# EAGLE design Gamepad (EAGLE 9.6.2)
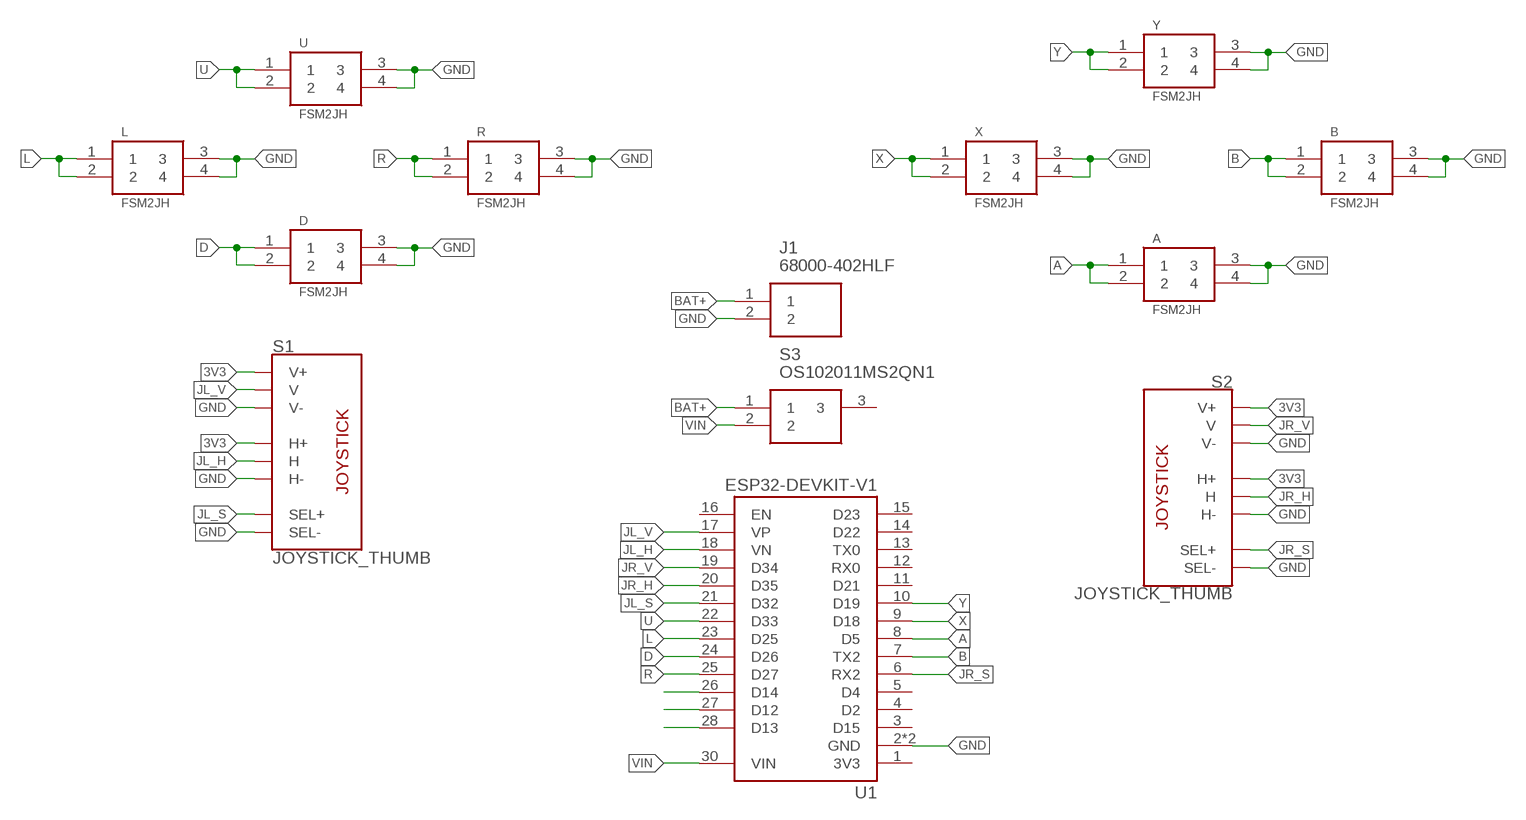
[diagram p0: schematic, sheet 1]

## Parts
A  FSM2JH  [FSM2JH]
B  FSM2JH  [FSM2JH]
D  FSM2JH  [FSM2JH]
J1  68000-402HLF  [68000-402HLF]
L  FSM2JH  [FSM2JH]
R  FSM2JH  [FSM2JH]
S1  JOYSTICK_THUMB  [JOYSTICK]
S2  JOYSTICK_THUMB  [JOYSTICK]
S3  OS102011MS2QN1  [OS102011MA1QN1]
U  FSM2JH  [FSM2JH]
U1  ESP32-DEVKIT-V1  [MODULE_ESP32_DEVKIT_V1]
X  FSM2JH  [FSM2JH]
Y  FSM2JH  [FSM2JH]

## Nets
3V3: S1.H1(H+) S1.V1(V+) S2.H1(H+) S2.V1(V+)
A: A.1 A.2 U1.8(D5)
B: B.1 B.2 U1.7(TX2)
BAT+: J1.1 S3.1
D: D.1 D.2 U1.24(D26)
GND: A.3 A.4 B.3 B.4 D.3 D.4 J1.2 L.3 L.4 R.3 R.4 S1.B2A(SEL-) S1.H3(H-) S1.V3(V-) S2.B2A(SEL-) S2.H3(H-) S2.V3(V-) U1.2(GND) U1.29(GND) U.3 U.4 X.3 X.4 Y.3 Y.4
JL_H: S1.H2(H) U1.18(VN)
JL_S: S1.B1A(SEL+) U1.21(D32)
JL_V: S1.V2(V) U1.17(VP)
JR_H: S2.H2(H) U1.20(D35)
JR_S: S2.B1A(SEL+) U1.6(RX2)
JR_V: S2.V2(V) U1.19(D34)
L: L.1 L.2 U1.23(D25)
N$19: U1.26(D14)
N$20: U1.27(D12)
N$21: U1.28(D13)
R: R.1 R.2 U1.25(D27)
U: U1.22(D33) U.1 U.2
VIN: S3.2 U1.30(VIN)
X: U1.9(D18) X.1 X.2
Y: U1.10(D19) Y.1 Y.2
Unconnected: S3.3 U1.1(3V3) U1.3(D15) U1.4(D2) U1.5(D4) U1.11(D21) U1.12(RX0) U1.13(TX0) U1.14(D22) U1.15(D23) U1.16(EN)

## Library data of the parts
A B D L R U X Y = Buttons:FSM2JH
J1 = Pines:68000-402HLF: FCI BergStik Series, Series Number 68000, 2.54mm Pitch 2 Way 1 Row Straight Header, Through Hole Termination, 3A Source: Datasheet <https://componentsearchengine.com/Datasheets/2/68000-402HLF.pdf>; ARROW_PART_NUMBER: 68000-402HLF; ARROW_PRICE-STOCK: https://www.arrow.com/en/products/68000-402hlf/amphenol-fci?region=nac; DESCRIPTION: FCI BergStik Series, Series Number 68000, 2.54mm Pitch 2 Way 1 Row Straight Header, Through Hole Termination, 3A; HEIGHT: 8.39mm; MANUFACTURER_NAME: Amphenol; MANUFACTURER_PART_NUMBER: 68000-402HLF; MOUSER_PART_NUMBER: 649-68000-402HLF; MOUSER_PRICE-STOCK: https://www.mouser.co.uk/ProductDetail/Amphenol-FCI/68000-402HLF?qs=Jhn0v8ulSDtl9VR1zMrdxQ%3D%3D
S1 S2 = Buttons:JOYSTICK_THUMB: Analog Thumb Joystick This is a joystick very similar to the ‘analog’ joysticks on PS2 (PlayStation 2) controllers. Directional movements are simply two potentiometers - one for each axis. Pots are ~10k each. This joystick also has a select button that is actuated when the joystick is pressed down. SparkFun Products Thumb Joystick <https://www.sparkfun.com/products/9032> (COM-09032) SparkFun Thumb Joystick Breakout <https://www.sparkfun.com/products/9110> (BOB-09110) SparkFun Joystick Shield Kit <https://www.sparkfun.com/products/9760> (DEV-09760); PROD_ID: COMP-09744; SF_SKU: COM-09032
S3 = Buttons:OS102011MS2QN1: Switch Slide Miniature SPDT 0.1A 12VDC Through Hole Slide Switch SPDT On-On 0.1 A@ 12 V dc Slide Source: Datasheet <http://www.ckswitches.com/media/1428/os.pdf>; ALLIED_NUMBER: 70272264; ALLIED_PRICE-STOCK: https://www.alliedelec.com/c-k-os102011ms2qn1/70272264/; ARROW_PART_NUMBER: OS102011MS2QN1; ARROW_PRICE-STOCK: https://www.arrow.com/en/products/os102011ms2qn1/ck; DESCRIPTION: Switch Slide Miniature SPDT 0.1A 12VDC Through Hole Slide Switch SPDT On-On 0.1 A@ 12 V dc Slide; HEIGHT: mm; MANUFACTURER_NAME: C & K COMPONENTS; MANUFACTURER_PART_NUMBER: OS102011MS2QN1; RS_PART_NUMBER: 7874864; RS_PRICE-STOCK: http://uk.rs-online.com/web/p/products/7874864
U1 = Boards:ESP32-DEVKIT-V1: Dual core, Wi-Fi: 2.4 GHz up to 150 Mbits/s,BLE (Bluetooth Low Energy) and legacy Bluetooth, 32 bits, Up to 240 MHz Check availability <https://pricing.snapeda.com/parts/ESP32-DEVKIT-V1/Do%20it/view-part?ref=eda>; AVAILABILITY: Not in stock; DESCRIPTION: Dual core, Wi-Fi: 2.4 GHz up to 150 Mbits/s,BLE (Bluetooth Low Energy) and legacy Bluetooth, 32 bits, Up to 240 MHz; MF: Do it; MP: ESP32-DEVKIT-V1; PACKAGE: None; PRICE: None

## Board
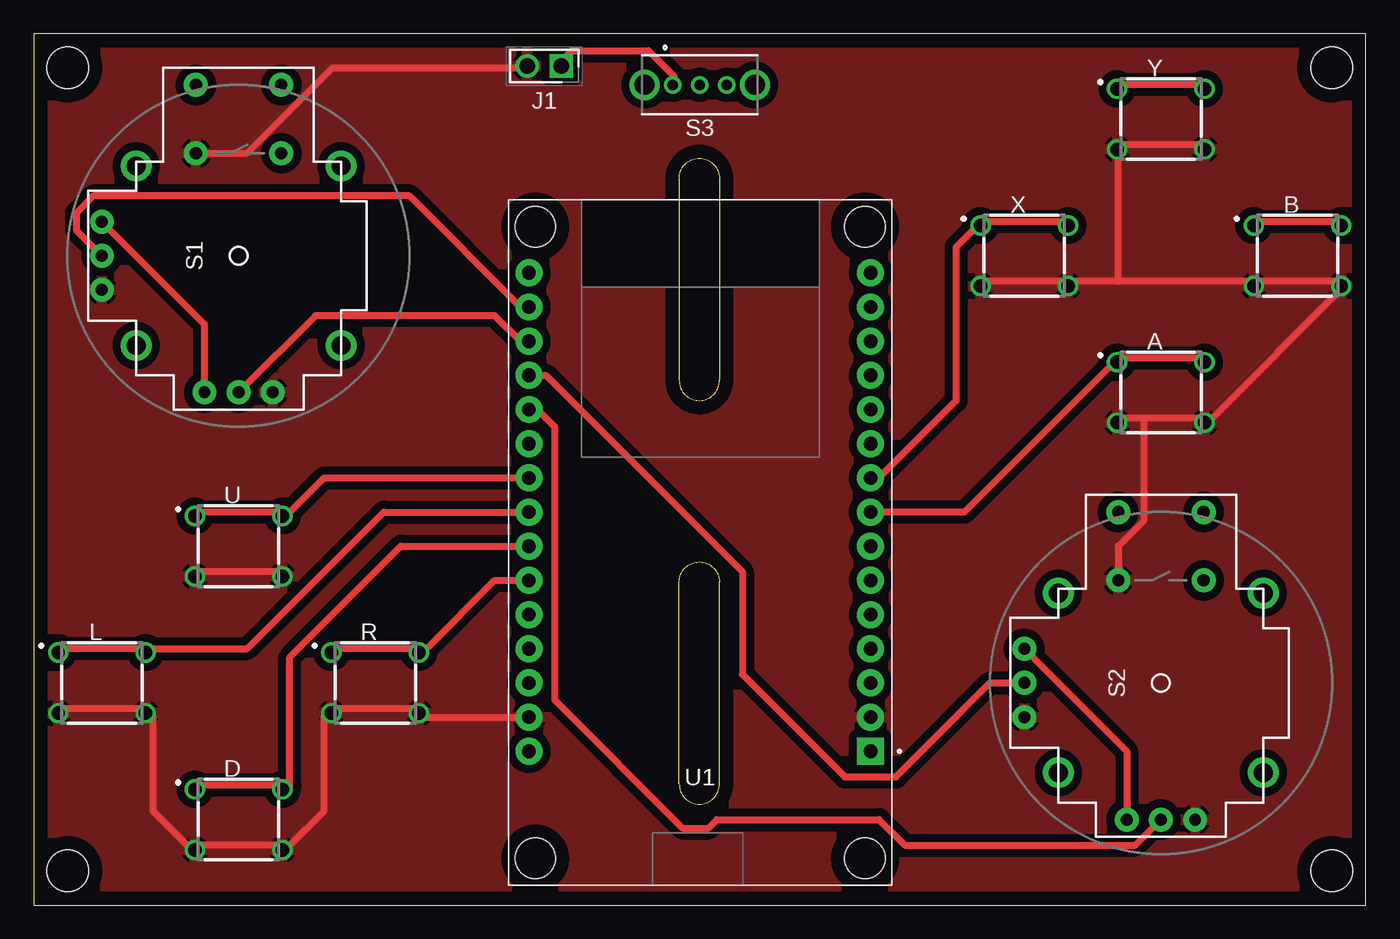
[diagram p1: board, top side]
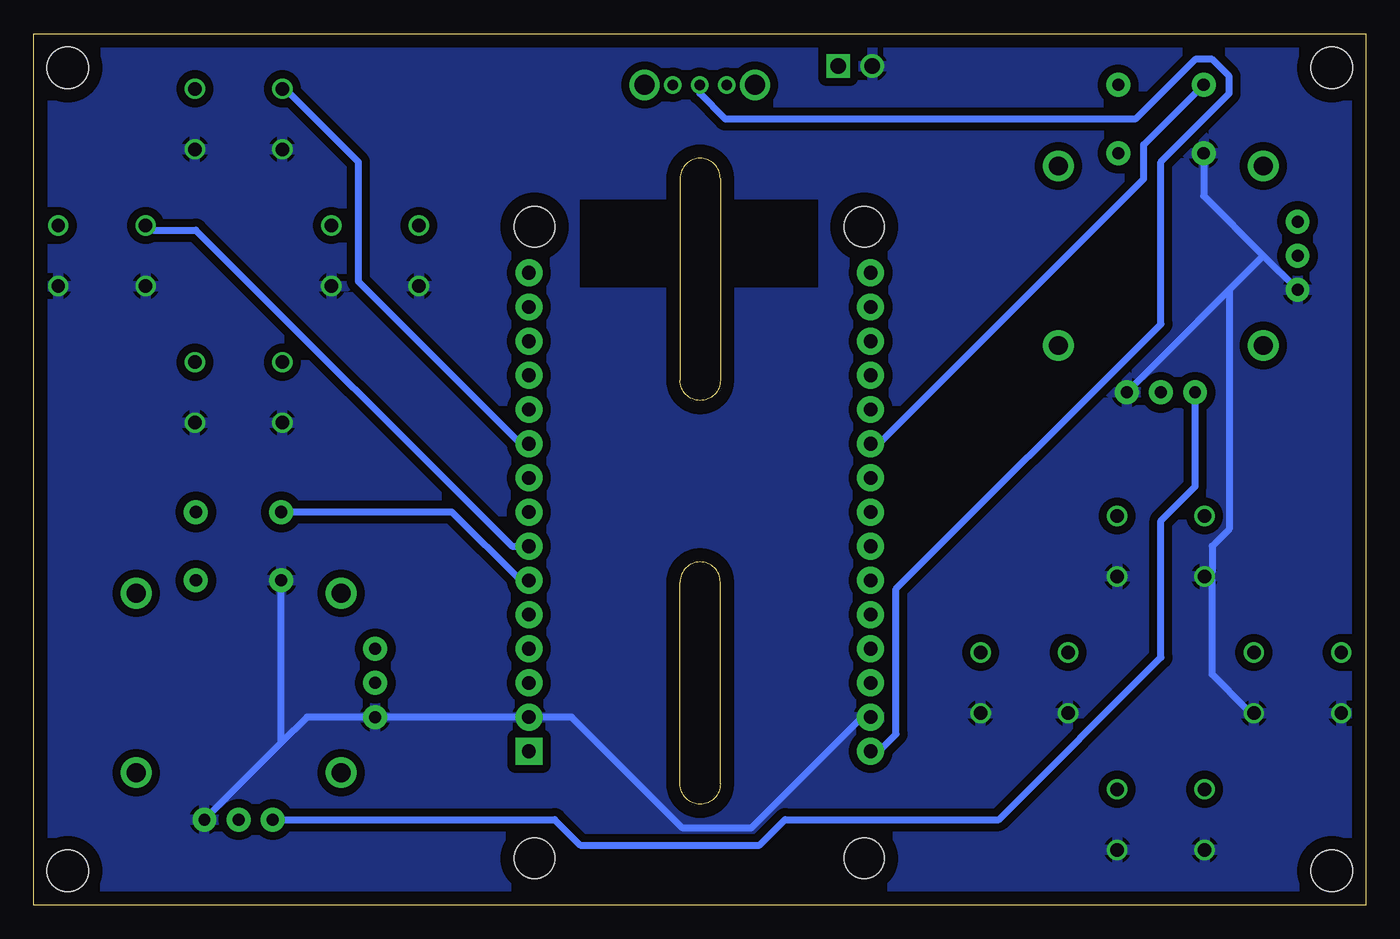
[diagram p2: board, bottom side, seen from below]

Size 99.06 x 64.77 mm. Coordinates in mm from the lower left corner, seen from the top.
Outline: 0,0 99.06,0 99.06,64.77 0,64.77 0,0
Outline: 48,54 arc-180 51,54 51,39 arc-180 48,39 48,54
Outline: 48,9 arc180 51,9 51,24 arc180 48,24 48,9
Copper layers (1*16): Top 0.035mm / dielectric 1.5mm / Bottom 0.035mm
Design rules "default *": minimum track width 20mil, minimum drill 0.35mm, track to track 24mil, track to pad 24mil, pad to pad 6mil, via to via 6mil, smd to smd 6mil, copper to edge 40mil, drill to drill 6mil, minimum pad ring 10mil, minimum via ring 8mil, stop-mask expansion 4mil, vias tented up to drill 0mil, thermal gap 10mil
Holes 3.1 mm at 2.54,2.54 2.54,62.23 96.52,62.23 96.52,2.54

### Footprints (pad centres in the part's own frame; a part is rotated, then mirrored left to right if it is on the bottom)
FSM2JH = drill 1 pad 1.5: 1 -3.25,2.25; 2 3.25,2.25; 3 -3.25,-2.25; 4 3.25,-2.25
68000-402HLF = drill 1.15 pad 1.725 square: 1 0,0 | drill 1.15 pad 1.725: 2 2.54,0
JOYSTICK = drill 0.9 pad 1.778: B1A -3.175,12.7; B1B 3.175,12.7; B2A -3.175,7.62; B2B 3.175,7.62 | drill 0.889 pad 1.778: H1 -2.54,-10.16; H2 0,-10.16; H3 2.54,-10.16; V1 -10.16,2.54; V2 -10.16,0; V3 -10.16,-2.54 | drill 1.397 pad 2.286: MOUNT1 -7.62,6.668; MOUNT2 -7.62,-6.668; MOUNT3 7.62,-6.668; MOUNT4 7.62,6.668
OS102011MA1QN1 = drill 0.8 pad 1.3: 1 -2,0; 2 0,0; 3 2,0 | drill 1.5 pad 2.25: 4 -4.1,0; 5 4.1,0
MODULE_ESP32_DEVKIT_V1 = drill 1.02 pad 2 square: 1 12.7,-15.24 | drill 1.02 pad 2: 2 12.7,-12.7; 3 12.7,-10.16; 4 12.7,-7.62; 5 12.7,-5.08; 6 12.7,-2.54; 7 12.7,0; 8 12.7,2.54; 9 12.7,5.08; 10 12.7,7.62; 11 12.7,10.16; 12 12.7,12.7; 13 12.7,15.24; 14 12.7,17.78; 15 12.7,20.32; 16 -12.7,20.32; 17 -12.7,17.78; 18 -12.7,15.24; 19 -12.7,12.7; 20 -12.7,10.16; 21 -12.7,7.62; 22 -12.7,5.08; 23 -12.7,2.54; 24 -12.7,0; 25 -12.7,-2.54; 26 -12.7,-5.08; 27 -12.7,-7.62; 28 -12.7,-10.16; 29 -12.7,-12.7; 30 -12.7,-15.24 | hole 3: 12.28,23.75; -12.23,23.75; -12.23,-23.2; 12.28,-23.2

### Placement (x,y rotation side)
A  83.82,38.1 0 top
B  93.98,48.26 0 top
D  15.24,6.35 0 top
J1  39.24,62.36 180 top
L  5.08,16.51 0 top
R  25.4,16.51 0 top
S1  15.24,48.26 0 top
S2  83.82,16.51 0 top
S3  49.53,60.96 0 top
U  15.24,26.67 0 top
U1  49.53,26.67 0 top
X  73.66,48.26 0 top
Y  83.82,58.42 0 top

### Tracks (layer width: path | path; a pad name or v marks a point on that pad's centre or on a via)
3V3
  Top 0.508: S1.H1 12.7,43.18 S1.V1 | S2.H1 81.28,11.43 S2.V1
  Bottom 0.508: S1.H1 12.7,31.11 15.24,28.57 15.24,18.41 27.3,6.35 43.18,6.35 45.09,4.45 58.42,4.45 60.33,6.35 S2.H1
A
  Top 0.508: A.2 87,40.64 80.64,40.64 A.1 80.01,40.01 69.22,29.21 U1.8
B
  Top 0.508: B.1 90.81,50.8 97.16,50.8 B.2
  Bottom 0.508: U1.7 63.5,26.67 87,50.16 90.17,50.16 B.1
BAT+
  Top 0.508: S3.1 47.62,60.96 47.62,61.59 45.72,63.5 40.01,63.5 39.37,62.87 J1.1
D
  Top 0.508: D.1 12.06,8.89 18.41,8.89 D.2 19.05,8.89 19.05,18.41 27.3,26.67 U1.24
GND
  Top 0.508: Y.4 87,56.52 80.64,56.52 Y.3 80.64,55.88 80.64,46.35 | X.3 70.48,46.35 76.83,46.35 X.4 77.47,46.35 80.64,46.35 | 82.55,36.2 87,36.2 A.4 87.63,36.2 97.16,45.72 B.4 97.16,46.35 90.81,46.35 B.3 90.17,46.35 80.64,46.35 | 82.55,36.2 80.64,36.2 A.3 | S2.B2A 80.64,26.67 82.55,28.57 82.55,36.2 | U1.29 29.21,13.97 R.4 28.57,14.61 22.23,14.61 R.3 21.59,13.97 21.59,6.99 19.05,4.45 D.4 18.41,4.45 12.06,4.45 D.3 11.43,4.45 8.89,6.99 8.89,13.97 L.4 8.26,14.61 1.91,14.61 L.3 | U.3 12.06,24.77 18.41,24.77 U.4 | S1.B2A 15.88,55.88 22.23,62.23 36.2,62.23 J1.2
  Bottom 0.508: 80.64,12.06 78.74,13.97 S2.V3 U1.2 59.05,13.97 50.8,5.71 45.72,5.71 37.47,13.97 U1.29 | 80.64,12.06 S2.H3 | 80.64,12.06 S2.B2A | L.4 8.89,14.61 11.43,17.14 11.43,24.13 U.3 11.43,24.77 11.43,26.67 10.16,27.94 10.16,45.72 | 7.62,48.26 12.06,52.7 S1.B2A | 7.62,48.26 S1.V3 | 7.62,48.26 10.16,45.72 | 10.16,45.72 S1.H3
  pour Top: -0.13,-0.13 99.19,-0.13 99.19,64.9 -0.13,64.9
  pour Bottom: -0.25,-0.25 99.31,-0.25 99.31,65.02 -0.25,65.02
JL_H
  Top 0.508: S1.H2 20.95,43.81 34.29,43.81 36.2,41.91 U1.18
JL_S
  Bottom 0.508: S1.B1A 16.51,56.52 16.51,53.98 36.2,34.29 U1.21
JL_V
  Top 0.508: S1.V2 3.17,50.16 3.17,51.44 4.45,52.7 27.94,52.7 36.2,44.45 U1.17
JR_H
  Top 0.508: S2.H2 81.92,4.45 64.77,4.45 62.87,6.35 50.8,6.35 50.16,5.71 48.26,5.71 38.73,15.24 38.73,35.56 37.47,36.83 U1.20
JR_S
  Bottom 0.508: S2.B1A 67.94,29.21 62.87,24.13 U1.6
JR_V
  Top 0.508: S2.V2 71.12,16.51 64.14,9.53 60.33,9.53 52.7,17.14 52.7,24.77 38.1,39.37 U1.19
L
  Top 0.508: L.1 1.91,19.05 8.26,19.05 L.2 8.89,19.05 15.88,19.05 26.04,29.21 U1.23
R
  Top 0.508: R.1 22.23,19.05 28.57,19.05 R.2 29.21,19.05 34.29,24.13 U1.25
U
  Top 0.508: U.1 12.06,29.21 18.41,29.21 U.2 19.05,29.21 21.59,31.75 U1.22
VIN
  Bottom 0.508: S3.2 49.53,60.33 47.62,58.42 17.14,58.42 12.7,62.87 11.43,62.87 10.16,61.59 10.16,60.33 15.24,55.24 15.24,43.18 34.92,23.5 34.92,12.7 36.2,11.43 U1.30
X
  Top 0.508: X.2 76.83,50.8 70.48,50.8 X.1 69.85,50.16 68.58,48.9 68.58,37.47 62.87,31.75 U1.9
Y
  Top 0.508: Y.1 80.64,60.96 87,60.96 Y.2
  Bottom 0.508: U1.10 62.87,34.29 74.93,46.35 74.93,55.24 80.01,60.33 Y.1